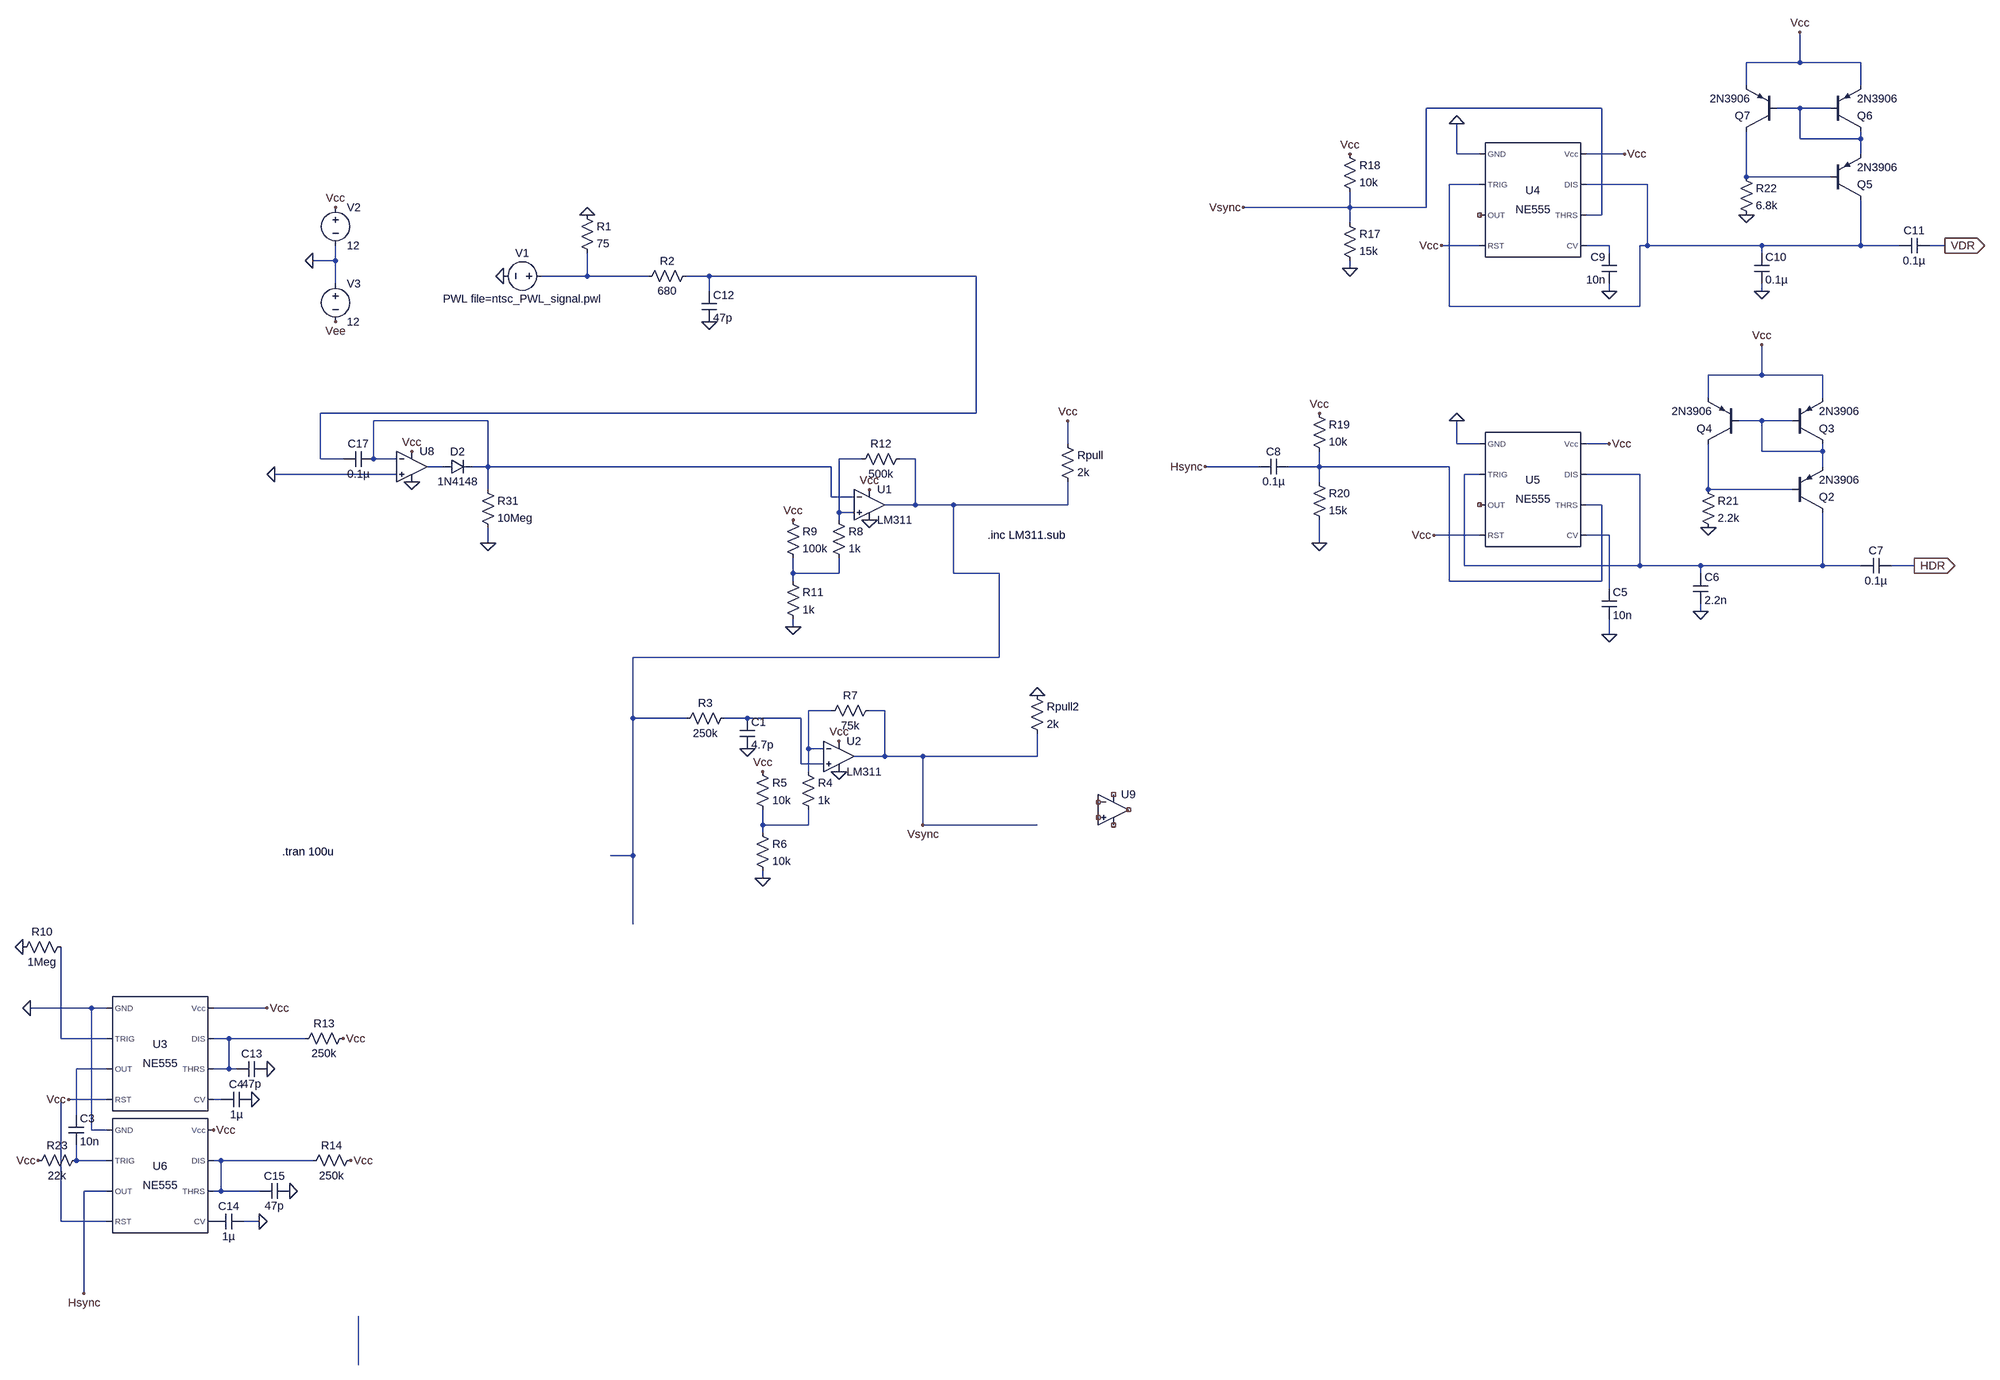
[diagram p0: schematic fifthIteration.asc]
fifthIteration.asc, the LTspice schematic file:
Version 4.1
SHEET 1 3116 2276
WIRE 2704 -640 2704 -704
WIRE 2704 -640 2592 -640
WIRE 2832 -640 2704 -640
WIRE 2592 -592 2592 -640
WIRE 2832 -592 2832 -640
WIRE 2288 -544 1920 -544
WIRE 2704 -544 2656 -544
WIRE 2768 -544 2704 -544
WIRE 2704 -480 2704 -544
WIRE 2832 -480 2832 -496
WIRE 2832 -480 2704 -480
WIRE 1984 -448 1984 -512
WIRE 2032 -448 1984 -448
WIRE 2336 -448 2256 -448
WIRE 2832 -448 2832 -480
WIRE 2592 -400 2592 -496
WIRE 2768 -400 2592 -400
WIRE 2032 -384 1968 -384
WIRE 2384 -384 2256 -384
WIRE 1760 -336 1760 -368
WIRE 1760 -336 1536 -336
WIRE 1920 -336 1920 -544
WIRE 1920 -336 1760 -336
WIRE 2288 -320 2288 -544
WIRE 2288 -320 2256 -320
WIRE 1760 -304 1760 -336
WIRE 2032 -256 1952 -256
WIRE 2304 -256 2256 -256
WIRE 2384 -256 2384 -384
WIRE 2384 -256 2368 -256
WIRE 2624 -256 2384 -256
WIRE 2832 -256 2832 -352
WIRE 2832 -256 2624 -256
WIRE 2912 -256 2832 -256
WIRE 3008 -256 2976 -256
WIRE 2304 -240 2304 -256
WIRE 2624 -240 2624 -256
WIRE -368 -224 -368 -256
WIRE -368 -224 -416 -224
WIRE 1760 -208 1760 -224
WIRE 160 -192 160 -240
WIRE 160 -192 64 -192
WIRE 288 -192 160 -192
WIRE 416 -192 368 -192
WIRE 976 -192 416 -192
WIRE -368 -176 -368 -224
WIRE 416 -160 416 -192
WIRE 2304 -160 2304 -176
WIRE 2624 -160 2624 -176
WIRE 1968 -128 1968 -384
WIRE 2368 -128 2368 -256
WIRE 2368 -128 1968 -128
WIRE 2624 16 2624 -48
WIRE 2624 16 2512 16
WIRE 2752 16 2624 16
WIRE 2512 64 2512 16
WIRE 2752 64 2752 16
WIRE 976 96 976 -192
WIRE 976 96 -400 96
WIRE -48 112 -288 112
WIRE 2624 112 2576 112
WIRE 2688 112 2624 112
WIRE 1168 160 1168 112
WIRE 1984 160 1984 112
WIRE 2032 160 1984 160
WIRE 2304 160 2256 160
WIRE 2624 176 2624 112
WIRE 2752 176 2752 160
WIRE 2752 176 2624 176
WIRE -400 192 -400 96
WIRE -352 192 -400 192
WIRE -288 192 -288 112
WIRE -240 192 -288 192
WIRE 736 192 688 192
WIRE 848 192 816 192
WIRE -144 208 -176 208
WIRE -48 208 -48 112
WIRE -48 208 -80 208
WIRE 672 208 -48 208
WIRE 1568 208 1456 208
WIRE 1696 208 1696 176
WIRE 1696 208 1632 208
WIRE 1968 208 1696 208
WIRE 2752 208 2752 176
WIRE -240 224 -496 224
WIRE 2032 224 2000 224
WIRE 2368 224 2256 224
WIRE 1696 240 1696 208
WIRE -48 256 -48 208
WIRE 2512 256 2512 160
WIRE 2688 256 2512 256
WIRE 672 272 672 208
WIRE 720 272 672 272
WIRE 848 288 848 192
WIRE 848 288 784 288
WIRE 928 288 848 288
WIRE 1168 288 1168 240
WIRE 1168 288 928 288
WIRE 2288 288 2256 288
WIRE 688 304 688 192
WIRE 720 304 688 304
WIRE 688 320 688 304
WIRE 2032 352 1936 352
WIRE 2304 352 2256 352
WIRE -48 368 -48 336
WIRE 1696 368 1696 320
WIRE 2000 416 2000 224
WIRE 2368 416 2368 224
WIRE 2368 416 2000 416
WIRE 2496 416 2368 416
WIRE 2752 416 2752 304
WIRE 2752 416 2496 416
WIRE 2832 416 2752 416
WIRE 2944 416 2896 416
WIRE 592 432 592 400
WIRE 688 432 688 400
WIRE 688 432 592 432
WIRE 928 432 928 288
WIRE 1024 432 928 432
WIRE 2496 432 2496 416
WIRE 592 448 592 432
WIRE 1968 448 1968 208
WIRE 2288 448 2288 288
WIRE 2288 448 1968 448
WIRE 2304 464 2304 352
WIRE 2496 512 2496 496
WIRE 592 544 592 528
WIRE 2304 560 2304 528
WIRE 1024 608 1024 432
WIRE 1024 608 256 608
WIRE 672 720 624 720
WIRE 784 720 752 720
WIRE 256 736 256 608
WIRE 368 736 256 736
WIRE 496 736 448 736
WIRE 608 736 496 736
WIRE 624 800 624 720
WIRE 656 800 624 800
WIRE 784 816 784 720
WIRE 784 816 720 816
WIRE 864 816 784 816
WIRE 1104 816 1104 768
WIRE 1104 816 864 816
WIRE 608 832 608 736
WIRE 656 832 608 832
WIRE 624 848 624 800
WIRE 528 960 528 928
WIRE 624 960 624 928
WIRE 624 960 528 960
WIRE 864 960 864 816
WIRE 1104 960 864 960
WIRE 528 976 528 960
WIRE 256 1024 256 736
WIRE 256 1024 208 1024
WIRE 528 1072 528 1056
WIRE 256 1168 256 1024
WIRE -880 1344 -1008 1344
WIRE -848 1344 -880 1344
WIRE -512 1344 -624 1344
WIRE -944 1408 -944 1216
WIRE -848 1408 -944 1408
WIRE -592 1408 -624 1408
WIRE -432 1408 -592 1408
WIRE -848 1472 -912 1472
WIRE -592 1472 -592 1408
WIRE -592 1472 -624 1472
WIRE -576 1472 -592 1472
WIRE -848 1536 -928 1536
WIRE -608 1536 -624 1536
WIRE -912 1568 -912 1472
WIRE -880 1600 -880 1344
WIRE -848 1600 -880 1600
WIRE -912 1664 -912 1632
WIRE -848 1664 -912 1664
WIRE -608 1664 -624 1664
WIRE -416 1664 -608 1664
WIRE -848 1728 -896 1728
WIRE -608 1728 -608 1664
WIRE -608 1728 -624 1728
WIRE -528 1728 -608 1728
WIRE -944 1792 -944 1536
WIRE -848 1792 -944 1792
WIRE -528 1792 -560 1792
WIRE -896 1968 -896 1728
WIRE -320 2160 -320 2016
FLAG -16 -192 0
FLAG 160 -320 0
FLAG 1760 -208 0
FLAG 1760 -448 Vcc
FLAG 1696 96 Vcc
FLAG 1696 368 0
FLAG 1984 112 0
FLAG 2304 560 0
FLAG 2496 512 0
FLAG 2512 336 0
FLAG 2944 416 HDR
IOPIN 2944 416 Out
FLAG 2336 -448 Vcc
FLAG 1984 -512 0
FLAG 2304 -160 0
FLAG 1952 -256 Vcc
FLAG 2592 -320 0
FLAG 2704 -704 Vcc
FLAG 2624 -160 0
FLAG 3008 -256 VDR
IOPIN 3008 -256 Out
FLAG 1536 -336 Vsync
FLAG 1456 208 Hsync
FLAG 416 -96 0
FLAG 592 544 0
FLAG 752 256 Vcc
FLAG -368 -336 Vcc
FLAG -368 -96 Vee
FLAG -416 -224 0
FLAG 2304 160 Vcc
FLAG 2624 -48 Vcc
FLAG 1936 352 Vcc
FLAG 1168 112 Vcc
FLAG 592 320 Vcc
FLAG 752 320 0
FLAG -48 368 0
FLAG -208 176 Vcc
FLAG -496 224 0
FLAG -208 240 0
FLAG 496 800 0
FLAG 688 784 Vcc
FLAG 528 848 Vcc
FLAG 688 848 0
FLAG 864 960 Vsync
FLAG -1008 1344 0
FLAG -928 1536 Vcc
FLAG -512 1344 Vcc
FLAG -544 1536 0
FLAG -352 1408 Vcc
FLAG -512 1472 0
FLAG -624 1600 Vcc
FLAG -528 1792 0
FLAG -336 1664 Vcc
FLAG -464 1728 0
FLAG 1104 688 0
FLAG 528 1072 0
FLAG -896 1968 Hsync
FLAG -992 1664 Vcc
FLAG -1024 1216 0
DATAFLAG 592 432 ""
DATAFLAG 528 960 ""
SYMBOL voltage 80 -192 R90
WINDOW 0 -32 56 VBottom 2
WINDOW 3 32 56 VTop 2
WINDOW 123 0 0 Left 0
WINDOW 39 0 0 Left 0
SYMATTR InstName V1
SYMATTR Value PWL file=ntsc_PWL_signal.pwl
SYMBOL res 144 -336 R0
SYMATTR InstName R1
SYMATTR Value 75
SYMBOL res 1744 -320 R0
SYMATTR InstName R17
SYMATTR Value 15k
SYMBOL res 1744 -464 R0
SYMATTR InstName R18
SYMATTR Value 10k
SYMBOL Misc\\NE555 2144 -352 R0
SYMATTR InstName U4
SYMBOL Misc\\NE555 2144 256 R0
SYMATTR InstName U5
SYMBOL res 1680 80 R0
SYMATTR InstName R19
SYMATTR Value 10k
SYMBOL res 1680 224 R0
SYMATTR InstName R20
SYMATTR Value 15k
SYMBOL cap 2288 464 R0
SYMATTR InstName C5
SYMATTR Value 10n
SYMBOL cap 2480 432 R0
SYMATTR InstName C6
SYMATTR Value 2.2n
SYMBOL cap 2896 400 R90
WINDOW 0 0 32 VBottom 2
WINDOW 3 32 32 VTop 2
SYMATTR InstName C7
SYMATTR Value 0.1µ
SYMBOL pnp 2688 304 M180
SYMATTR InstName Q2
SYMATTR Value 2N3906
SYMBOL pnp 2688 160 M180
SYMATTR InstName Q3
SYMATTR Value 2N3906
SYMBOL pnp 2576 160 R180
SYMATTR InstName Q4
SYMATTR Value 2N3906
SYMBOL res 2496 240 R0
SYMATTR InstName R21
SYMATTR Value 2.2k
SYMBOL cap 1632 192 R90
WINDOW 0 0 32 VBottom 2
WINDOW 3 32 32 VTop 2
SYMATTR InstName C8
SYMATTR Value 0.1µ
SYMBOL cap 2320 -176 R180
WINDOW 0 24 56 Left 2
WINDOW 3 24 8 Left 2
SYMATTR InstName C9
SYMATTR Value 10n
SYMBOL pnp 2768 -352 M180
SYMATTR InstName Q5
SYMATTR Value 2N3906
SYMBOL pnp 2768 -496 M180
SYMATTR InstName Q6
SYMATTR Value 2N3906
SYMBOL pnp 2656 -496 R180
SYMATTR InstName Q7
SYMATTR Value 2N3906
SYMBOL res 2576 -416 R0
SYMATTR InstName R22
SYMATTR Value 6.8k
SYMBOL cap 2608 -240 R0
SYMATTR InstName C10
SYMATTR Value 0.1µ
SYMBOL cap 2976 -272 R90
WINDOW 0 0 32 VBottom 2
WINDOW 3 32 32 VTop 2
SYMATTR InstName C11
SYMATTR Value 0.1µ
SYMBOL res 384 -208 R90
WINDOW 0 0 56 VBottom 2
WINDOW 3 32 56 VTop 2
SYMATTR InstName R2
SYMATTR Value 680
SYMBOL cap 400 -160 R0
SYMATTR InstName C12
SYMATTR Value 47p
SYMBOL res 672 304 R0
SYMATTR InstName R8
SYMATTR Value 1k
SYMBOL res 576 304 R0
SYMATTR InstName R9
SYMATTR Value 100k
SYMBOL res 576 432 R0
SYMATTR InstName R11
SYMATTR Value 1k
SYMBOL res 832 176 R90
WINDOW 0 0 56 VBottom 2
WINDOW 3 32 56 VTop 2
SYMATTR InstName R12
SYMATTR Value 500k
SYMBOL res 1152 144 R0
SYMATTR InstName Rpull
SYMATTR Value 2k
SYMBOL voltage -368 -352 R0
SYMATTR InstName V2
SYMATTR Value 12
SYMBOL voltage -368 -192 R0
SYMATTR InstName V3
SYMATTR Value 12
SYMBOL OpAmps\\opamp2 752 224 R0
SYMATTR InstName U1
SYMATTR Value LM311
SYMBOL cap -288 176 R90
WINDOW 0 0 32 VBottom 2
WINDOW 3 32 32 VTop 2
SYMATTR InstName C17
SYMATTR Value 0.1µ
SYMBOL OpAmps\\UniversalOpAmp2 -208 208 R0
SYMATTR InstName U8
SYMBOL diode -144 224 R270
WINDOW 0 32 32 VTop 2
WINDOW 3 0 32 VBottom 2
SYMATTR InstName D2
SYMATTR Value 1N4148
SYMBOL res -64 240 R0
SYMATTR InstName R31
SYMATTR Value 10Meg
SYMBOL res 464 720 R90
WINDOW 0 0 56 VBottom 2
WINDOW 3 32 56 VTop 2
SYMATTR InstName R3
SYMATTR Value 250k
SYMBOL cap 480 736 R0
SYMATTR InstName C1
SYMATTR Value 4.7p
SYMBOL res 608 832 R0
SYMATTR InstName R4
SYMATTR Value 1k
SYMBOL res 512 832 R0
SYMATTR InstName R5
SYMATTR Value 10k
SYMBOL res 512 960 R0
SYMATTR InstName R6
SYMATTR Value 10k
SYMBOL res 768 704 R90
WINDOW 0 0 56 VBottom 2
WINDOW 3 32 56 VTop 2
SYMATTR InstName R7
SYMATTR Value 75k
SYMBOL res 1088 672 R0
SYMATTR InstName Rpull2
SYMATTR Value 2k
SYMBOL OpAmps\\opamp2 688 752 R0
SYMATTR InstName U2
SYMATTR Value LM311
SYMBOL OpAmps\\UniversalOpAmp2 1264 928 R0
SYMATTR InstName U9
SYMBOL Misc\\NE555 -736 1440 R0
SYMATTR InstName U3
SYMBOL Misc\\NE555 -736 1696 R0
SYMATTR InstName U6
SYMBOL cap -544 1520 R90
WINDOW 0 0 32 VBottom 2
WINDOW 3 32 32 VTop 2
SYMATTR InstName C4
SYMATTR Value 1µ
SYMBOL res -336 1392 R90
WINDOW 0 0 56 VBottom 2
WINDOW 3 32 56 VTop 2
SYMATTR InstName R13
SYMATTR Value 250k
SYMBOL cap -512 1456 R90
WINDOW 0 0 32 VBottom 2
WINDOW 3 32 32 VTop 2
SYMATTR InstName C13
SYMATTR Value 47p
SYMBOL cap -560 1776 R90
WINDOW 0 0 32 VBottom 2
WINDOW 3 32 32 VTop 2
SYMATTR InstName C14
SYMATTR Value 1µ
SYMBOL res -320 1648 R90
WINDOW 0 0 56 VBottom 2
WINDOW 3 32 56 VTop 2
SYMATTR InstName R14
SYMATTR Value 250k
SYMBOL cap -464 1712 R90
WINDOW 0 0 32 VBottom 2
WINDOW 3 32 32 VTop 2
SYMATTR InstName C15
SYMATTR Value 47p
SYMBOL res -928 1200 R90
WINDOW 0 0 56 VBottom 2
WINDOW 3 32 56 VTop 2
SYMATTR InstName R10
SYMATTR Value 1Meg
SYMBOL cap -928 1568 R0
SYMATTR InstName C3
SYMATTR Value 10n
SYMBOL res -896 1648 R90
WINDOW 0 0 56 VBottom 2
WINDOW 3 32 56 VTop 2
SYMATTR InstName R23
SYMATTR Value 22k
TEXT -480 1016 Left 2 !.tran 100u
TEXT 1000 352 Left 2 !.inc LM311.sub

The netlist it stands for:
* fifthIteration.asc
V1 N005 0 PWL file=ntsc_PWL_signal.pwl
R1 0 N005 75
R17 Vsync 0 15k
R18 Vcc Vsync 10k
X§U4 0 N003 NC_01 Vcc N004 Vsync N003 Vcc NE555  ; pins GND TRIG OUT RST CV THRS DIS Vcc
X§U5 0 N013 NC_02 Vcc N015 N012 N013 Vcc NE555  ; pins GND TRIG OUT RST CV THRS DIS Vcc
R19 Vcc N012 10k
R20 N012 0 15k
C5 N015 0 10n
C6 N013 0 2.2n
C7 HDR N013 0.1µ
Q2 N013 N014 N008 0 2N3906
Q3 N008 N008 Vcc 0 2N3906
Q4 N014 N008 Vcc 0 2N3906
R21 N014 0 2.2k
C8 N012 Hsync 0.1µ
C9 0 N004 10n
Q5 N003 N002 N001 0 2N3906
Q6 N001 N001 Vcc 0 2N3906
Q7 N002 N001 Vcc 0 2N3906
R22 N002 0 6.8k
C10 N003 0 0.1µ
C11 VDR N003 0.1µ
R2 N006 N005 680
C12 N006 0 47p
R8 N009 N016 1k
R9 Vcc N016 100k
R11 N016 0 1k
R12 N010 N009 500k
Rpull Vcc N010 2k
V2 Vcc 0 12
V3 0 Vee 12
X§U1 N009 N007 Vcc 0 N010 LM311  ; pins In+ In- V+ V- OUT
C17 N007 N006 0.1µ
X§U8 0 N007 Vcc 0 N011 level2 Avol=1Meg GBW=10Meg Slew=10Meg Ilimit=25m Rail=0 Vos=0 En=0 Enk=0 In=0 Ink=0 Rin=500Meg  ; pins In+ In- V+ V- OUT
D2 N011 N007 1N4148
R31 N007 0 10Meg
R3 N018 N010 250k
C1 N018 0 4.7p
R4 N017 N019 1k
R5 Vcc N019 10k
R6 N019 0 10k
R7 Vsync N017 75k
Rpull2 0 Vsync 2k
X§U2 N018 N017 Vcc 0 Vsync LM311  ; pins In+ In- V+ V- OUT
X§U9 NC_03 NC_04 NC_05 NC_06 NC_07 level2 Avol=1Meg GBW=10Meg Slew=10Meg Ilimit=25m Rail=0 Vos=0 En=0 Enk=0 In=0 Ink=0 Rin=500Meg  ; pins In+ In- V+ V- OUT
X§U3 0 N020 N022 Vcc N023 N021 N021 Vcc NE555  ; pins GND TRIG OUT RST CV THRS DIS Vcc
X§U6 0 N024 Hsync N026 P001 N025 N025 Vcc NE555  ; pins GND TRIG OUT RST CV THRS DIS Vcc
C4 0 N023 1µ
R13 Vcc N021 250k
C13 0 N021 47p
C14 0 P001 1µ
R14 Vcc N025 250k
C15 0 N025 47p
R10 N020 0 1Meg
C3 N022 N024 10n
R23 N024 Vcc 22k
.model D D
.lib standard.dio
.model NPN NPN
.model PNP PNP
.lib standard.bjt
.tran 100u
.inc LM311.sub
.lib NE555.sub
.lib UniversalOpAmp2.lib
.backanno
.end